# Altium schematic sheet PowerManagement.SchDoc
size A3; SheetNumber: 3; SheetTotal: 6
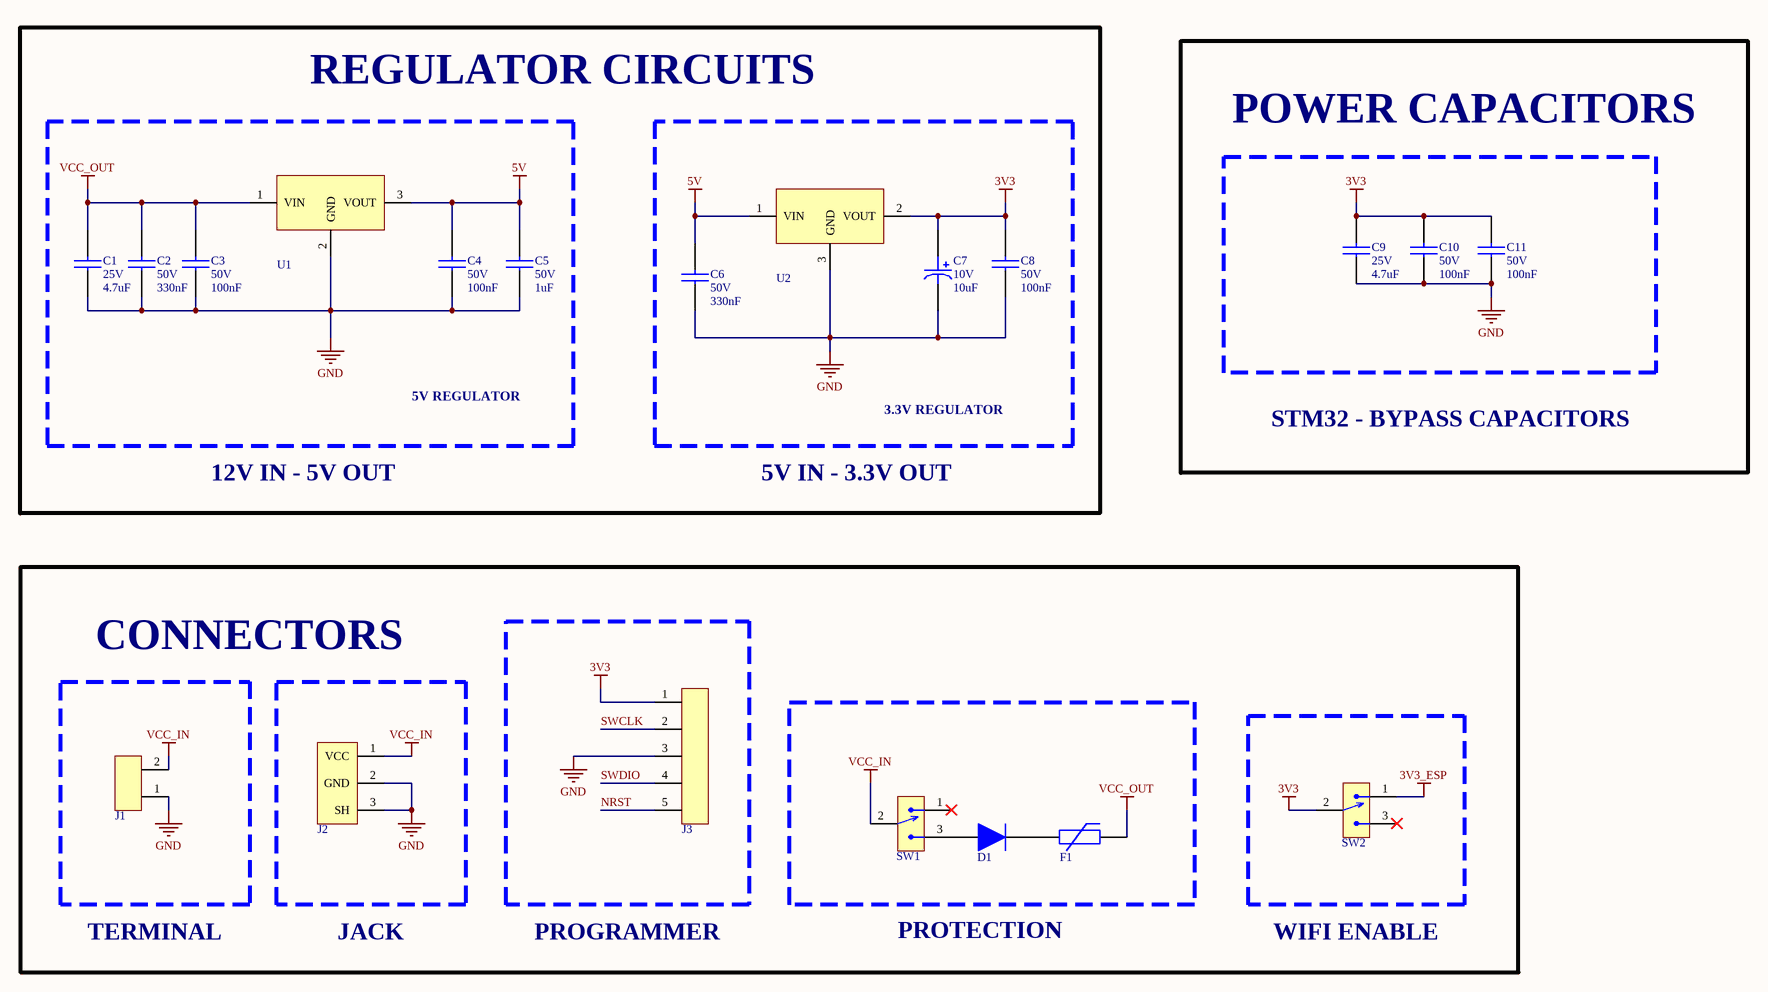
[diagram p0: PowerManagement.SchDoc]

## Parts
C1  Voltage Rating: 25V  Capacitance: 4.7uF  [CAP_0805]  (hidden comment: CL21A475KAQNNNE)
C2  Voltage Rating (DC): 50V  Capacitance: 330nF  [CAP_0603]  (hidden comment: CGA3E3X7R1H334K080AB)
C3  Voltage Rating (DC): 50V  Capacitance: 100nF  [CAP_0603]  (hidden comment: C0603C104K5RACTU)
C4  Voltage Rating (DC): 50V  Capacitance: 100nF  [CAP_0603]  (hidden comment: C0603C104K5RACTU)
C5  Voltage Rating: 50V  Capacitance: 1uF  [CAP_0805]  (hidden comment: CL21B105KBFNNNE)
C6  Voltage Rating (DC): 50V  Capacitance: 330nF  [CAP_0603]  (hidden comment: CGA3E3X7R1H334K080AB)
C7  Voltage Rating: 10V  Capacitance: 10uF  [CAP_1206_TANT]  (hidden comment: T491A106K010AT)
C8  Voltage Rating (DC): 50V  Capacitance: 100nF  [CAP_0603]  (hidden comment: C0603C104K5RACTU)
C9  Voltage Rating: 25V  Capacitance: 4.7uF  [CAP_0805]  (hidden comment: CL21A475KAQNNNE)
C10  Voltage Rating (DC): 50V  Capacitance: 100nF  [CAP_0603]  (hidden comment: C0603C104K5RACTU)
C11  Voltage Rating (DC): 50V  Capacitance: 100nF  [CAP_0603]  (hidden comment: C0603C104K5RACTU)
D1  1N4148WS  [SOD323F]  (value not drawn)
F1  PRG21BC1R0MM1RA  [FUSE_0805]  (value not drawn)
J1  282836-2  [TERMINAL]  (value not drawn)
J2  PJ-037AH-SMT-TR  [JACK]  (value not drawn)
J3  61300511121  [5x1 Male Header 2.54mm]  (value not drawn)
SW1  EG1215AA  [EG1215AA]  (value not drawn)
SW2  EG1215AA  [EG1215AA]  (value not drawn)
U1  L7805CD2T-TR  [D2PAK-TO-263-3]  (value not drawn)
U2  LD29150DT33R  [DPAK-TO252]  (value not drawn)

## Blocks framed on the sheet
POWER CAPACITORS: C9-C11
5V REGULATOR: C1-C5 U1
3.3V REGULATOR: C6-C8 U2
CONNECTORS: D1 F1 J1-J3 SW1 SW2

## Nets
3V3: C7.1 C8.2 C9.2 C10.2 C11.2 J3.1 SW2.2 U2.2(VOUT)
3V3_ESP: SW2.1
5V: C4.2 C5.2 C6.2 U1.3(VOUT) U2.1(VIN)
GND: C1.1 C2.1 C3.1 C4.1 C5.1 C6.1 C7.2 C8.1 C9.1 C10.1 C11.1 J1.1 J2.2(GND) J2.3(SH) J3.3 U1.2(GND) U2.3(GND)
VCC_IN: J1.2 J2.1(VCC) SW1.2
VCC_OUT: C1.2 C2.2 C3.2 F1.1 U1.1(VIN)
NRST: J3.5
SWCLK: J3.2
SWDIO: J3.4
NetD1_1: D1.1 SW1.3
NetD1_2: D1.2 F1.2

Not connected (* = marked no-connect by the designer): SW1 1*; SW2 3*

## Notes on the sheet
- REGULATOR CIRCUITS
- STM32 - BYPASS CAPACITORS
- 12V IN - 5V OUT
- 5V IN - 3.3V OUT
- TERMINAL
- JACK
- PROGRAMMER
- PROTECTION
- WIFI ENABLE
- DOSYA ADI / FILE NAME
- TANIM / DESCRIPTION
- HAZIRLAYAN / PREPARED BY
- YAYIN TARİHİ / REL. DATE
- BOYUT / SIZE
- SAYFA / SHEET
- /

## Library data of the parts
C1 C9 = CAP CER 4.7uF 0805: CAP CER 4.7uF %10 0805; Manufacturer: Samsung; Tolerance: 10%; Dielectric: X5R; DesignedBy: Aslı Kurt; Supplier 1: Digi-Key; Manufacturer Part Number: CL21A475KAQNNNE; RoHS: Yes; Category: Ceramic Capacitors; Stock 1: 1477018; Pricing 1: 1=0,11000, 10=0,08100, 50=0,04580, 100=0,03800, 500=0,02664, 1000=0,02205 (USD); Mount: Surface Mount; Case/Package: 0805; Case Code (Metric): 2012; Case Code (Imperial): 0805; Min Operating Temperature: -55°C; Max Operating Temperature: 85°C; Package Quantity: 1; Packaging: Tape and Reel; Voltage Rating (DC): 25V; Series: CL; Construction: Flat; Length: 2mm; Width: 0.049inch; Height: 1.25mm; Thickness: 0.055inch; Depth: 1.25mm; Radiation Hardening: No; Lead Free: Lead Free; RoHS Compliant: Yes; ComponentLink1URL: https://datasheet.ciiva.com/25798/cl21a475kaqnnne-25798882.pdf?src-supplier=Digi-Key; ComponentLink1Description: https://datasheet.ciiva.com/25798/cl21a475kaqnnne-25798882.pdf?src-supplier=Digi-Key; Supplier Part Number 1: 1276-1244-1-ND
C2 C6 = CAP CER 330nF 0603: Multilayer Ceramic Capacitor, 0.33 uF, 50 V, ± 10%, X7R, 0603 [1608 Metric]; Manufacturer: TDK; DesignedBy: Aslı Kurt; Material: 4241ConductorMaterial; Supplier 1: Rs; Manufacturer Part Number: CGA3E3X7R1H334K080AB; RoHS: Yes; Category: Ceramic Capacitors; Stock 1: 1350; Pricing 1: 50=0,082, 250=0,066, 500=0,058, 1000=0,049 (GBP); Mount: Surface Mount; Case/Package: 0603; Case Code (Metric): 1608; Case Code (Imperial): 0603; Weight: 7.1E-05oz; Min Operating Temperature: -55°C; Max Operating Temperature: 125°C; Packaging: Tape and Reel; Voltage Rating: 50V; Tolerance: 10%; Dielectric: X7R; Termination: SMD/SMT; Package Quantity: 4000; Series: CGA; Length: 0.063inch; Width: 0.031inch; Height: 0.8mm; Thickness: 0.035inch; Ratings: AEC-Q200; RoHS Compliant: Yes; ComponentLink1URL: http://www.mouser.com/ds/2/400/lcc_automotive_general_en-843974.pdf?src-supplier=Mouser; ComponentLink1Description: http://www.mouser.com/ds/2/400/lcc_automotive_general_en-843974.pdf?src-supplier=Mouser; ComponentLink2URL: https://datasheet.octopart.com/CGA3E3X7R1H334K080AB-TDK-datasheet-43366117.pdf?src-supplier=Future+Electronics; ComponentLink2Description: https://datasheet.octopart.com/CGA3E3X7R1H334K080AB-TDK-datasheet-43366117.pdf?src-supplier=Future+Electronics; ComponentLink3URL: https://product.tdk.com/info/en/documents/chara_sheet/CGA3E3X7R1H334K080AB.pdf?src-supplier=Digikey; ComponentLink3Description: https://product.tdk.com/info/en/documents/chara_sheet/CGA3E3X7R1H334K080AB.pdf?src-supplier=Digikey; ComponentLink4URL: https://product.tdk.com/info/en/catalog/datasheets/mlcc_automotive_general_en.pdf?src-supplier=Digikey; ComponentLink4Description: https://product.tdk.com/info/en/catalog/datasheets/mlcc_automotive_general_en.pdf?src-supplier=Digikey; ComponentLink5URL: http://product.tdk.com/capacitor/mlcc/class/print_detail_pdf.php?lang=en&part_no=CGA3E3X7R1H334K080AB&src-supplier=Avnet; ComponentLink5Description: http://product.tdk.com/capacitor/mlcc/class/print_detail_pdf.php?lang=en&part_no=CGA3E3X7R1H334K080AB&src-supplier=Avnet; ComponentLink6URL: https://datasheet.octopart.com/CGA3E3X7R1H334K080AB-TDK-datasheet-165583812.pdf?src-supplier=TME; ComponentLink6Description: https://datasheet.octopart.com/CGA3E3X7R1H334K080AB-TDK-datasheet-165583812.pdf?src-supplier=TME; Supplier 2: Avnet; Stock 2: 26394; Pricing 2: 1=0,231, 10=0,105, 25=0,093, 50=0,08, 100=0,068 (USD); Supplier 3: Farnell; Stock 3: 76750; Pricing 3: 10=0,156, 100=0,0848, 500=0,0677, 1000=0,0505, 2000=0,0453, 4000=0,04, 20000=0,0371, 40000=0,0362 (EUR); Supplier 4: Mouser; Stock 4: 154875; Pricing 4: 1=0,23, 10=0,098, 50=0,098, 100=0,063, 1000=0,053, 10000=0,032 (USD); Supplier 5: Digikey; Stock 5: 1242048; Pricing 5: 1=0,24, 10=0,139, 50=0,0982, 100=0,0858, 500=0,06458, 1000=0,05797 (USD); Supplier Part Number 1: 2427476; Supplier Part Number 2: 71AH2809; Supplier Part Number 3: 3416368; Supplier Part Number 4: 810-CGA3E3X7R1H334KB; Supplier Part Number 5: 445-174426-1-ND
C3 C4 C8 C10 C11 = CAP CER 100nF 0603: CAP CER 100nF %10 0603 SMD; Manufacturer: KEMET; DesignedBy: Aslı Kurt; Dielectric Material: Ceramic; Tolerance: 10%; Dielectric: X7R; Dissipation Factor: 2.5%; Supplier 1: Digi-Key; Manufacturer Part Number: C0603C104K5RACTU; RoHS: Yes; Category: Ceramic Capacitors; Stock 1: 1666186; Pricing 1: 1=0,12000, 10=0,08500, 50=0,04620, 100=0,03770, 500=0,02696, 1000=0,02118 (USD); Mount: Surface Mount; Case/Package: 0603; Number of Pins: 2; Case Code (Metric): 1608; Case Code (Imperial): 0603; Contact Plating: Tin,Matte; Min Operating Temperature: -55°C; Max Operating Temperature: 125°C; Packaging: Tape and Reel; Package Quantity: 1; Termination: SMD/SMT; Voltage: 50V; Voltage Rating: 50V; Series: SMD Comm X7R; Length: 0.063inch; Width: 0.031inch; Height: 0.8mm; Thickness: 0.034inch; Lead Pitch: 0.7mm; Depth: 0.8mm; Radiation Hardening: No; RoHS Compliant: Yes; REACH SVHC: No SVHC; ComponentLink1URL: https://datasheet.ciiva.com/7823/kem-c1002-x7r-smd-7823591.pdf?src-supplier=Element14; ComponentLink1Description: https://datasheet.ciiva.com/7823/kem-c1002-x7r-smd-7823591.pdf?src-supplier=Element14; ComponentLink2URL: https://datasheet.ciiva.com/14602/70095383-14602583.pdf?src-supplier=Allied+Electronics; ComponentLink2Description: https://datasheet.ciiva.com/14602/70095383-14602583.pdf?src-supplier=Allied+Electronics; ComponentLink3URL: https://datasheet.ciiva.com/5999/kem-c1002-x7r-smd-5999400.pdf?src-supplier=Farnell; ComponentLink3Description: https://datasheet.ciiva.com/5999/kem-c1002-x7r-smd-5999400.pdf?src-supplier=Farnell; ComponentLink4URL: https://datasheet.ciiva.com/7823/kem-c1002-x7r-smd-7823592.pdf?src-supplier=Element14; ComponentLink4Description: https://datasheet.ciiva.com/7823/kem-c1002-x7r-smd-7823592.pdf?src-supplier=Element14; ComponentLink5URL: https://datasheet.ciiva.com/28645/1851736-28645640.pdf?src-supplier=Element14; ComponentLink5Description: https://datasheet.ciiva.com/28645/1851736-28645640.pdf?src-supplier=Element14; ComponentLink6URL: https://datasheet.ciiva.com/14585/70095383-14585209.pdf?src-supplier=Allied+Electronics; ComponentLink6Description: https://datasheet.ciiva.com/14585/70095383-14585209.pdf?src-supplier=Allied+Electronics; Supplier Part Number 1: 399-5089-1-ND
C5 = CAP CER 1uF 0805: CAP CER 1uF %10 0805; Manufacturer: Samsung; DesignedBy: Aslı Kurt; Tolerance: 10%; Dielectric: X7R; Supplier 1: Digi-Key; Manufacturer Part Number: CL21B105KBFNNNE; RoHS: Yes; Category: Ceramic Capacitors; Stock 1: 958000; Pricing 1: 2000=0,02138, 4000=0,01956 (USD); Mount: Surface Mount; Case/Package: 0805; Case Code (Metric): 2012; Case Code (Imperial): 0805; Min Operating Temperature: -55°C; Max Operating Temperature: 125°C; Packaging: Tape and Reel; Package Quantity: 1; Voltage: 50V; Series: CL; Construction: Flat; Length: 2mm; Width: 0.049inch; Height: 1.25mm; Thickness: 0.053inch; Depth: 1.25mm; Radiation Hardening: No; RoHS Compliant: Yes; ComponentLink1URL: https://datasheet.ciiva.com/25800/cl21b105kbfnnne-25800291.pdf?src-supplier=Digi-Key; ComponentLink1Description: https://datasheet.ciiva.com/25800/cl21b105kbfnnne-25800291.pdf?src-supplier=Digi-Key; ComponentLink2URL: https://datasheet.ciiva.com/16449/cl21b105kbfnnne-16449003.pdf?src-supplier=Future+Electronics; ComponentLink2Description: https://datasheet.ciiva.com/16449/cl21b105kbfnnne-16449003.pdf?src-supplier=Future+Electronics; ComponentLink3URL: https://datasheet.ciiva.com/26838/getdatasheetpartid-354075-26838668.pdf?src-supplier=Verical; ComponentLink3Description: https://datasheet.ciiva.com/26838/getdatasheetpartid-354075-26838668.pdf?src-supplier=Verical; Supplier Part Number 1: 1276-1029-2-ND
C7 = CAP TANT 10uF 1206: Cap Tant Solid 10uF 10V A CASE 10% (3.2 X 1.6 X 1.6mm) SMD 3216-18 4 Ohm 125 C T/R; Manufacturer: KEMET; DesignedBy: Aslı Kurt; Dielectric Material: Tantalum; ESR (Equivalent Series Resistance): 4R; Dissipation Factor: 6%; Ripple Current: 137mA; Leakage Current: 1uA; Polarity: Polar; Supplier 1: Digikey; Manufacturer Part Number: T491A106K010AT; RoHS: Yes; Category: Tantalum Capacitors; Stock 1: 1419669; Pricing 1: 1=0,32, 10=0,209, 50=0,154, 100=0,1255, 500=0,09904, 1000=0,08364 (USD); Mount: Surface Mount,PCB; Case/Package: 1206; Case Code (Metric): 3216; Case Code (Imperial): 1206; Min Operating Temperature: -55°C; Max Operating Temperature: 125°C; Tolerance: 10%; Packaging: Tape and Reel; Features: General Purpose; Series: T491; Voltage Rating (DC): 10V; Package Quantity: 1; Termination: SMD/SMT; Construction: Flat; Voltage: 10V; Length: 3.2mm; Width: 0.063inch; Height: 1.6mm; Height - Seated (Max): 0.071inch; Depth: 1.6mm; Size: 1.6mm; RoHS Compliant: Yes; Lead Free: 5697LeadFree; Reach SVHC Compliant: No; ComponentLink1URL: https://datasheet.ciiva.com/7668/1732743-7668006.pdf?src-supplier=Element14; ComponentLink1Description: https://datasheet.ciiva.com/7668/1732743-7668006.pdf?src-supplier=Element14; ComponentLink2URL: https://datasheet.ciiva.com/27052/1573249-27052559.pdf?src-supplier=Jameco; ComponentLink2Description: https://datasheet.ciiva.com/27052/1573249-27052559.pdf?src-supplier=Jameco; ComponentLink3URL: https://datasheet.ciiva.com/257/kem-t2005-t491-257584.pdf?src-supplier=Digikey; ComponentLink3Description: https://datasheet.ciiva.com/257/kem-t2005-t491-257584.pdf?src-supplier=Digikey; ComponentLink4URL: https://datasheet.ciiva.com/11793/0900766b80718482-11793106.pdf?src-supplier=Rs; ComponentLink4Description: https://datasheet.ciiva.com/11793/0900766b80718482-11793106.pdf?src-supplier=Rs; ComponentLink5URL: https://datasheet.ciiva.com/7668/kem-t2005-t491-7668139.pdf?src-supplier=Element14; ComponentLink5Description: https://datasheet.ciiva.com/7668/kem-t2005-t491-7668139.pdf?src-supplier=Element14; ComponentLink6URL: https://datasheet.ciiva.com/7668/1854511-7668007.pdf?src-supplier=Element14; ComponentLink6Description: https://datasheet.ciiva.com/7668/1854511-7668007.pdf?src-supplier=Element14; ComponentLink7URL: https://datasheet.ciiva.com/7668/1446014-7668008.pdf?src-supplier=Element14; ComponentLink7Description: https://datasheet.ciiva.com/7668/1446014-7668008.pdf?src-supplier=Element14; ComponentLink8URL: https://datasheet.ciiva.com/7668/1854511-7668005.pdf?src-supplier=Element14; ComponentLink8Description: https://datasheet.ciiva.com/7668/1854511-7668005.pdf?src-supplier=Element14; ComponentLink9URL: https://datasheet.ciiva.com/257/kem-t2005-t491-257585.pdf?src-supplier=Digikey; ComponentLink9Description: https://datasheet.ciiva.com/257/kem-t2005-t491-257585.pdf?src-supplier=Digikey; ComponentLink10URL: https://datasheet.ciiva.com/257/kem-t2005-t491-257586.pdf?src-supplier=Digikey; ComponentLink10Description: https://datasheet.ciiva.com/257/kem-t2005-t491-257586.pdf?src-supplier=Digikey; ComponentLink11URL: https://datasheet.ciiva.com/14586/70095774-14586699.pdf?src-supplier=Allied+Electronics; ComponentLink11Description: https://datasheet.ciiva.com/14586/70095774-14586699.pdf?src-supplier=Allied+Electronics; ComponentLink12URL: https://datasheet.ciiva.com/14596/70095774-14596972.pdf?src-supplier=Allied+Electronics; ComponentLink12Description: https://datasheet.ciiva.com/14596/70095774-14596972.pdf?src-supplier=Allied+Electronics; ComponentLink13URL: https://datasheet.ciiva.com/12882/kem-t2005-t491-12882826.pdf?src-supplier=Mouser; ComponentLink13Description: https://datasheet.ciiva.com/12882/kem-t2005-t491-12882826.pdf?src-supplier=Mouser; ComponentLink14URL: https://datasheet.ciiva.com/29244/458293-da-01-en-kondensator-10uf-3216-10pr-10v-85c-29244583.pdf?src-supplier=Conrad; ComponentLink14Description: https://datasheet.ciiva.com/29244/458293-da-01-en-kondensator-10uf-3216-10pr-10v-85c-29244583.pdf?src-supplier=Conrad; Supplier Part Number 1: 399-3684-1-ND
D1 = 1N4148WS: Diode, Single, 75 V, 150 mA, 1 V, 4 ns; Manufacturer: ON Semiconductor / Fairchild; DesignedBy: Aslı Kurt; Forward Current: 150mA; Reverse Recovery Time: 4ns; Max Repetitive Reverse Voltage (Vrrm): 75V; Power Dissipation: 200mW; Max Reverse Current: 5uA; Forward Voltage: 1V; Max Forward Surge Current (Ifsm): 2A; Supplier 1: Digi-Key; Manufacturer Part Number: 1N4148WS; RoHS: Yes; Category: Rectifier Diodes; Stock 1: 79118; Pricing 1: 1=0,17000, 10=0,12100, 100=0,06530, 500=0,05128, 1000=0,03562 (USD); Mount: Surface Mount; Number of Pins: 2; Contact Plating: Tin,Matte; Weight: 0.0276g; Min Operating Temperature: -55°C; Max Operating Temperature: 150°C; Packaging: Tape and Reel; Package Quantity: 1; Recovery Time: 4ns; Average Rectified Current: 150mA; Element Configuration: Single; Reverse Voltage: 75V; Max Reverse Voltage (DC): 75V; Series: -; Length: 1.8mm; Width: 1.35mm; Height: 1mm; Radiation Hardening: No; REACH SVHC: No SVHC; Lead Free: Lead Free; RoHS Compliant: Yes; ComponentLink1URL: https://datasheet.ciiva.com/25968/1n914bws-25968945.pdf?src-supplier=Avnet+Europe; ComponentLink1Description: https://datasheet.ciiva.com/25968/1n914bws-25968945.pdf?src-supplier=Avnet+Europe; ComponentLink2URL: https://datasheet.ciiva.com/30479/0900766b810e1cd3-30479206.pdf?src-supplier=RSComponents; ComponentLink2Description: https://datasheet.ciiva.com/30479/0900766b810e1cd3-30479206.pdf?src-supplier=RSComponents; ComponentLink3URL: https://datasheet.ciiva.com/910/1n4148ws-910381.pdf?src-supplier=Digi-Key; ComponentLink3Description: https://datasheet.ciiva.com/910/1n4148ws-910381.pdf?src-supplier=Digi-Key; ComponentLink4URL: https://datasheet.ciiva.com/15208/getdatasheetpartid-127819-15208358.pdf?src-supplier=Verical; ComponentLink4Description: https://datasheet.ciiva.com/15208/getdatasheetpartid-127819-15208358.pdf?src-supplier=Verical; ComponentLink5URL: https://datasheet.ciiva.com/8300/1n914bws-8300360.pdf?src-supplier=Avnet; ComponentLink5Description: https://datasheet.ciiva.com/8300/1n914bws-8300360.pdf?src-supplier=Avnet; ComponentLink6URL: https://datasheet.ciiva.com/910/1n4148ws-910380.pdf?src-supplier=Digi-Key; ComponentLink6Description: https://datasheet.ciiva.com/910/1n4148ws-910380.pdf?src-supplier=Digi-Key; ComponentLink7URL: https://datasheet.ciiva.com/910/1n4148ws-910382.pdf?src-supplier=Digi-Key; ComponentLink7Description: https://datasheet.ciiva.com/910/1n4148ws-910382.pdf?src-supplier=Digi-Key; Supplier Part Number 1: 1N4148WSFSCT-ND
F1 = PRG21BC1R0MM1RA: Thermistor PTC 1 Ohm 20% 2-Pin 0805 Surface Mount Solder Pad Embossed T/R; Manufacturer: Murata; DesignedBy: Aslı Kurt; Voltage Rating: 12V; Supplier 1: Mouser; Manufacturer Part Number: PRG21BC1R0MM1RA; RoHS: Yes; Category: Thermistors; Stock 1: 2720; Pricing 1: 1=0,62, 10=0,479, 50=0,479, 100=0,419, 1000=0,336, 10000=0,231 (USD); Lead Free: 5697LeadFree; ComponentLink1URL: https://datasheet.ciiva.com/30488/0900766b81259d6c-30488358.pdf?src-supplier=Rs; ComponentLink1Description: https://datasheet.ciiva.com/30488/0900766b81259d6c-30488358.pdf?src-supplier=Rs; ComponentLink2URL: https://datasheet.ciiva.com/327/ntc-ptcthermistorsforautomotive-327122.pdf?src-supplier=Digikey; ComponentLink2Description: https://datasheet.ciiva.com/327/ntc-ptcthermistorsforautomotive-327122.pdf?src-supplier=Digikey; ComponentLink3URL: https://datasheet.ciiva.com/29603/s0363e-29603286.pdf?src-supplier=Digikey; ComponentLink3Description: https://datasheet.ciiva.com/29603/s0363e-29603286.pdf?src-supplier=Digikey; ComponentLink4URL: https://datasheet.ciiva.com/29603/s0363e-29603287.pdf?src-supplier=Digikey; ComponentLink4Description: https://datasheet.ciiva.com/29603/s0363e-29603287.pdf?src-supplier=Digikey; ComponentLink5URL: https://datasheet.ciiva.com/29603/s0363e-29603289.pdf?src-supplier=Digikey; ComponentLink5Description: https://datasheet.ciiva.com/29603/s0363e-29603289.pdf?src-supplier=Digikey; ComponentLink6URL: https://datasheet.ciiva.com/3282/r90e-3282510.pdf?src-supplier=Avnet; ComponentLink6Description: https://datasheet.ciiva.com/3282/r90e-3282510.pdf?src-supplier=Avnet; Supplier 2: Arrow Electronics; Stock 2: 3860; Pricing 2: 387=0,3643, 1000=0,3353, 4000=0,2764 (USD); Supplier 3: Digikey; Stock 3: 24892; Pricing 3: 1=0,73, 5=0,612, 10=0,568, 25=0,5156, 50=0,4788, 100=0,4449, 500=0,37522, 1000=0,3487 (USD); Supplier 4: Digikey; Stock 4: 24892; Pricing 4: 1=0,73, 5=0,612, 10=0,568, 25=0,5156, 50=0,4788, 100=0,4449, 500=0,37522, 1000=0,3487 (USD); Supplier 5: Digikey; Stock 5: 24000; Pricing 5: 4000=0,23392, 8000=0,23138 (USD); Supplier Part Number 1: 81-PRG21BC1R0MM1RA; Supplier Part Number 2: PRG21BC1R0MM1RA; Supplier Part Number 3: 490-8511-1-ND; Supplier Part Number 4: 490-8511-6-ND; Supplier Part Number 5: 490-8511-2-ND
J1 = 2x1 TERMINAL 5mm: Connector, Terminal Block; Wire Receptacle; 2 Pos.; 16-30 AWG; 0.197 in. CL; Sid; Manufacturer: TE Connectivity; DesignedBy: Aslı Kurt; Plating: Brass; Number of Positions: 2; Number of Levels: 1; Current: 13.5A; Voltage: 300V; Interlock: Yes (With); Screw Flange: No (Without); Connector System: 5937ConnectorSystem; Voltage Rating (DC): 250V; Pitch: 5mm; Wire Gauge (Max): 30AWG; Thread Size: M3; Tail Length: 3.5mm; Approvals: UL; Supplier 1: Digikey; Manufacturer Part Number: 282836-2; RoHS: Yes; Category: Terminal Blocks; Stock 1: 33835; Pricing 1: 1=0,6, 10=0,578, 25=0,576, 50=0,5566, 100=0,4666, 300=0,43743, 600=0,41315, 1200=0,36211, 5100=0,31593 (USD); Mount: Through Hole; Color: Green; Contact Material: Brass; Housing Color: Green; Contact Plating: Tin; Housing Material: Polyamide; Insulation Material: Nylon; Min Operating Temperature: -40°C; Max Operating Temperature: 105°C; Number of Rows: 1; Termination: Solder; Series: Buchanan; Packaging: Tray; Package Quantity: 300; Number of Positions Per Level: 2; Number of Contacts: 2; Orientation: Straight; Current Rating: 13.5A; Number of Circuits: 2; Screwless Terminal Block: No (Without); Side Stackable: Yes (With); Operating Supply Voltage: 300V; Voltage Rating: 300V; Max Voltage Rating (AC): 300V; Number of Poles: 2; Max Supply Voltage (AC): 300V; Connector Type: Receptacle; Closed End: No (Without); Max Current Rating: 13.5A; Length: 10.6mm; Width: 10mm; Wire Gauge (Min): 30AWG; Wire/Cable Gauge: 30AWG; Depth: 8.2mm; Radiation Hardening: No; Flammability Rating: UL94 V-0; RoHS Compliant: Yes; ELV: Compliant; Lead Free: Lead Free; Reach SVHC Compliant: Unknown; ComponentLink1URL: https://datasheet.ciiva.com/7628/1731782-7628513.pdf?src-supplier=Element14; ComponentLink1Description: https://datasheet.ciiva.com/7628/1731782-7628513.pdf?src-supplier=Element14; ComponentLink2URL: https://datasheet.ciiva.com/16393/282836-2-16393382.pdf?src-supplier=Future+Electronics; ComponentLink2Description: https://datasheet.ciiva.com/16393/282836-2-16393382.pdf?src-supplier=Future+Electronics; ComponentLink3URL: https://datasheet.ciiva.com/15169/getdatasheetpartid-155855-15169553.pdf?src-supplier=Verical; ComponentLink3Description: https://datasheet.ciiva.com/15169/getdatasheetpartid-155855-15169553.pdf?src-supplier=Verical; ComponentLink4URL: https://datasheet.ciiva.com/11757/0900766b8002dc8a-11757385.pdf?src-supplier=Rs; ComponentLink4Description: https://datasheet.ciiva.com/11757/0900766b8002dc8a-11757385.pdf?src-supplier=Rs; ComponentLink5URL: https://datasheet.ciiva.com/823/eng-cd-282836-h10-823437.pdf?src-supplier=Digikey; ComponentLink5Description: https://datasheet.ciiva.com/823/eng-cd-282836-h10-823437.pdf?src-supplier=Digikey; ComponentLink6URL: https://datasheet.ciiva.com/3141/eng-cs-1308389-eurostyle-terminal-blocks-0607-3141118.pdf?src-supplier=Avnet; ComponentLink6Description: https://datasheet.ciiva.com/3141/eng-cs-1308389-eurostyle-terminal-blocks-0607-3141118.pdf?src-supplier=Avnet; ComponentLink7URL: https://datasheet.ciiva.com/30261/eng-cs-1308389-eurostyle-terminal-blocks-0607-30261813.pdf?src-supplier=Onlinecomponents.com; ComponentLink7Description: https://datasheet.ciiva.com/30261/eng-cs-1308389-eurostyle-terminal-blocks-0607-30261813.pdf?src-supplier=Onlinecomponents.com; Supplier Part Number 1: A98076-ND
J2 = PJ-037AH-SMT-TR: DC Power Connectors Power Jacks; Manufacturer: CUI; DesignedBy: Aslı Kurt; Number of Conductors: 2; Gender: Male; Shielding: Unshielded; Current Rating: 5A; Voltage Rating: 24V; Insulation Resistance: 100MR; Supplier 1: Digi-Key; Manufacturer Part Number: PJ-037AH-SMT-TR; RoHS: Yes; Category: Connectors; Stock 1: 4972; Pricing 1: 1=1,36000, 10=1,19300, 25=1,12320, 50=1,07640, 100=1,02960 (USD); Mount: Surface Mount,Through Hole; Case/Package: SMD/SMT; Color: Black; Contact Material: Copper; Contact Plating: Nickel; Housing Color: Black; Housing Material: Thermoplastic; Min Operating Temperature: -25°C; Max Operating Temperature: 85°C; Orientation: Horizontal; Package Quantity: 200; Termination: Solder; Connector Type: Jack; Contact Gender: Male; Packaging: Tape and Reel; Flammability Rating: UL94 V-0; ComponentLink1URL: http://www.mouser.com/ds/2/670/pj-037ah-smt-516065.pdf?src-supplier=Mouser; ComponentLink1Description: http://www.mouser.com/ds/2/670/pj-037ah-smt-516065.pdf?src-supplier=Mouser; ComponentLink2URL: https://www.cui.com/product/resource/digikeypdf/pj-037ah-smt-tr.pdf?src-supplier=Digi-Key; ComponentLink2Description: https://www.cui.com/product/resource/digikeypdf/pj-037ah-smt-tr.pdf?src-supplier=Digi-Key; ComponentLink3URL: http://www.cui.com/product/resource/digikeypdf/pj-037ah-smt.pdf?src-supplier=Digi-Key; ComponentLink3Description: http://www.cui.com/product/resource/digikeypdf/pj-037ah-smt.pdf?src-supplier=Digi-Key; Supplier Part Number 1: CP-037AHPJCT-ND
J3 = 5x1 Male Header 2.54mm: DesignedBy: Aslı Kurt
SW1 SW2 = EG1215AA: Slide Switch, SPDT, 0.025A, 24V, SMD; Manufacturer: E-Switch; DesignedBy: Aslı Kurt; Mechanical Life: 10000Cycles; Switch Function: On-On; Current Rating: 25mA; Actuator Type: Standard; Switch Travel: 1.5mm; Operating Force: 150gf; Zener Voltage: 9.1V; Tolerance: 4.95%; Max Power Dissipation: 5W; Impedance: 2R; Actuator Length: 1.4mm; Supplier 1: Digi-Key; Manufacturer Part Number: EG1215AA; RoHS: No; Stock 1: 6245; Pricing 1: 1=0,85000, 10=0,81900, 25=0,76560, 100=0,66470, 250=0,60480, 500=0,56070, 1000=0,51975 (USD); Mount: Surface Mount,Through Hole; Case/Package: Axial; Min Operating Temperature: -20°C; Max Operating Temperature: 175°C; Throw Configuration: SPDT; Packaging: Cut Tape; Voltage Rating (DC): 24V; Termination: Gull Wing; Electrical Life: 10000Cycles; ComponentLink1URL: https://media.digikey.com/pdf/Data%20Sheets/E-Switch%20PDFs/EG1215_Series_Ds.pdf?src-supplier=Digi-Key; ComponentLink1Description: https://media.digikey.com/pdf/Data%20Sheets/E-Switch%20PDFs/EG1215_Series_Ds.pdf?src-supplier=Digi-Key; ComponentLink2URL: http://www.farnell.com/datasheets/2645007.pdf?src-supplier=Farnell; ComponentLink2Description: http://www.farnell.com/datasheets/2645007.pdf?src-supplier=Farnell; Supplier Part Number 1: EG5720CT-ND
U1 = L7805CD2T-TR: Standard Regulator Pos 5V 1.5A 3-Pin(2+Tab) D2PAK T/R / IC REG LDO 5V 1.5A D2PAK; Manufacturer: STMicroelectronics; Uretici Kodu: L7805CDT-TR; Kılıf: DPAK; -Sicaklik: -40; +Sicaklik: +125; Max Input Voltage: 35V; Number of Outputs: 1; Polarity: Positive; Quiescent Current: 8mA; Output Type: Fixed; Min Input Voltage: 10V; Dropout Voltage: 2V; Min Output Voltage: 4.8V; Power Supply Rejection Ratio (PSRR): 62dB; Nominal Supply Current: 4.3mA; Number of Channels: 1NUMBER; DesignedBy: Aslı Kurt; Cins: IC; Supplier 1: Future Electronics; RoHS: Yes; Category: Voltage Regulators - Linear; Stock 1: 202000; Pricing 1: 1000=0,31, 3000=0,3, 5000=0,295, 10000=0,29, 20000=0,28 (USD); Mount: Surface Mount; Case/Package: TO-263; Number of Pins: 3; Weight: 7.1E-05oz; Min Operating Temperature: 0°C; Max Operating Temperature: 125°C; Output Voltage: 5V; Output Current: 1.5A; Packaging: Tape and Reel; Max Output Current: 1.5A; Package Quantity: 1000; Nominal Output Voltage: 5V; Number of Regulators: 1; Series: -; Length: 10.4mm; Width: 9.35mm; Height: 4.6mm; RoHS Compliant: Yes; Reach SVHC Compliant: No; Lead Free: Lead Free; ComponentLink1URL: https://datasheet.ciiva.com/36526/1991686-36526238.pdf?src-supplier=Jameco; ComponentLink1Description: https://datasheet.ciiva.com/36526/1991686-36526238.pdf?src-supplier=Jameco; ComponentLink2URL: https://datasheet.ciiva.com/1511/1805459-1511910.pdf?src-supplier=Element14; ComponentLink2Description: https://datasheet.ciiva.com/1511/1805459-1511910.pdf?src-supplier=Element14; ComponentLink3URL: https://datasheet.ciiva.com/2053/cd00000444-2053730.pdf?src-supplier=Digikey; ComponentLink3Description: https://datasheet.ciiva.com/2053/cd00000444-2053730.pdf?src-supplier=Digikey; ComponentLink4URL: https://datasheet.ciiva.com/4881/cd00000444-4881992.pdf?src-supplier=Mouser; ComponentLink4Description: https://datasheet.ciiva.com/4881/cd00000444-4881992.pdf?src-supplier=Mouser; ComponentLink5URL: https://datasheet.ciiva.com/16385/cd00000444-16385288.pdf?src-supplier=Future+Electronics; ComponentLink5Description: https://datasheet.ciiva.com/16385/cd00000444-16385288.pdf?src-supplier=Future+Electronics; ComponentLink6URL: https://datasheet.ciiva.com/46618/1805459-46618855.pdf?src-supplier=Newark; ComponentLink6Description: https://datasheet.ciiva.com/46618/1805459-46618855.pdf?src-supplier=Newark; ComponentLink7URL: https://datasheet.ciiva.com/22710/1805459-22710937.pdf?src-supplier=Element14; ComponentLink7Description: https://datasheet.ciiva.com/22710/1805459-22710937.pdf?src-supplier=Element14; ComponentLink8URL: https://datasheet.ciiva.com/7647/1805459-7647813.pdf?src-supplier=Element14; ComponentLink8Description: https://datasheet.ciiva.com/7647/1805459-7647813.pdf?src-supplier=Element14; ComponentLink9URL: https://datasheet.ciiva.com/2053/cd00000444-2053731.pdf?src-supplier=Digikey; ComponentLink9Description: https://datasheet.ciiva.com/2053/cd00000444-2053731.pdf?src-supplier=Digikey; ComponentLink10URL: https://datasheet.ciiva.com/2053/cd00000444-2053732.pdf?src-supplier=Digikey; ComponentLink10Description: https://datasheet.ciiva.com/2053/cd00000444-2053732.pdf?src-supplier=Digikey; Supplier 2: Mouser; Stock 2: 13102; Pricing 2: 1=0,83, 10=0,685, 50=0,685, 100=0,52, 1000=0,348, 10000=0,287 (USD); Supplier 3: Rs; Stock 3: 6020; Pricing 3: 50=0,516, 100=0,49, 250=0,463, 500=0,441 (GBP); Supplier 4: Avnet; Stock 4: 704; Pricing 4: 1=0,886, 10=0,741, 25=0,686, 50=0,631, 100=0,576 (USD); Supplier 5: Farnell; Stock 5: 8724; Pricing 5: 1=0,886, 10=0,702, 50=0,486, 200=0,45, 500=0,413 (EUR); Supplier 6: Digikey; Stock 6: 13327; Pricing 6: 1=0,83, 10=0,729, 25=0,6848, 100=0,5588, 250=0,51908, 500=0,44176 (USD); Supplier Part Number 6: 497-1171-1-ND; Supplier Part Number 5: 1366576; Supplier Part Number 4: 95M4314; Supplier Part Number 3: 7140657P; Supplier Part Number 2: 511-L7805CD2T-TR; Supplier Part Number 1: 4623278; Manufacturer Part Number: L7805CD2T-TR
U2 = LD29150DT33R: LD29150 Series 3.3 V 1.5 A Fixed Output SMT LDO Voltage Regulator - TO-252; Manufacturer: STMicroelectronics; Cins: IC; Uretici Kodu: LD1086DT33TR; Kılıf: DPAK; -Sicaklik: -40; +Sicaklik: +125; DesignedBy: Aslı Kurt; Supplier 1: Future Electronics; RoHS: No; Category: Voltage Regulators - Linear; Stock 1: 10000; Pricing 1: 2500=0,715, 5000=0,7, 7500=0,69, 10000=0,685, 12500=0,665 (USD); ComponentLink1URL: https://datasheet.ciiva.com/1569/1788499-1569956.pdf?src-supplier=Farnell; ComponentLink1Description: https://datasheet.ciiva.com/1569/1788499-1569956.pdf?src-supplier=Farnell; ComponentLink2URL: https://datasheet.ciiva.com/41440/001184976-da-01-en-ic-reg-ldo-3-3-ld29150dt33r-to-252-3-stm-41440118.pdf?src-supplier=Conrad; ComponentLink2Description: https://datasheet.ciiva.com/41440/001184976-da-01-en-ic-reg-ldo-3-3-ld29150dt33r-to-252-3-stm-41440118.pdf?src-supplier=Conrad; ComponentLink3URL: https://datasheet.ciiva.com/2044/cd00003403-2044031.pdf?src-supplier=Digikey; ComponentLink3Description: https://datasheet.ciiva.com/2044/cd00003403-2044031.pdf?src-supplier=Digikey; ComponentLink4URL: https://datasheet.ciiva.com/2044/cd00003403-2044032.pdf?src-supplier=Digikey; ComponentLink4Description: https://datasheet.ciiva.com/2044/cd00003403-2044032.pdf?src-supplier=Digikey; ComponentLink5URL: https://datasheet.ciiva.com/2044/cd00003403-2044033.pdf?src-supplier=Digikey; ComponentLink5Description: https://datasheet.ciiva.com/2044/cd00003403-2044033.pdf?src-supplier=Digikey; ComponentLink6URL: https://datasheet.ciiva.com/22694/1904189-22694855.pdf?src-supplier=Element14; ComponentLink6Description: https://datasheet.ciiva.com/22694/1904189-22694855.pdf?src-supplier=Element14; Supplier 2: Mouser; Stock 2: 10050; Pricing 2: 1=1,61, 10=1,37, 50=1,37, 100=1,1, 1000=0,789, 10000=0,68 (USD); Supplier 3: Rs; Stock 3: 170; Pricing 3: 10=1,218, 100=0,826, 500=0,782, 1000=0,61 (GBP); Supplier 4: Digikey; Stock 4: 12678; Pricing 4: 1=1,61, 10=1,443, 25=1,3608, 100=1,1596, 250=1,0888, 500=0,95268, 1000=0,78937 (USD); Supplier Part Number 2: 511-LD29150DT33R; Supplier Part Number 1: 6030624; Supplier Part Number 3: 6868704P; Supplier Part Number 4: 497-1496-1-ND; Manufacturer Part Number: LD29150DT33R